# EasyEDA schematic power_distribution_board_v3.json
TITLE: Motor Controller & Power-Distribution Board; REV: 3.0; Date: 05-OCT-2024; Sheet: 1/1; Company: ABH Manufacturing.
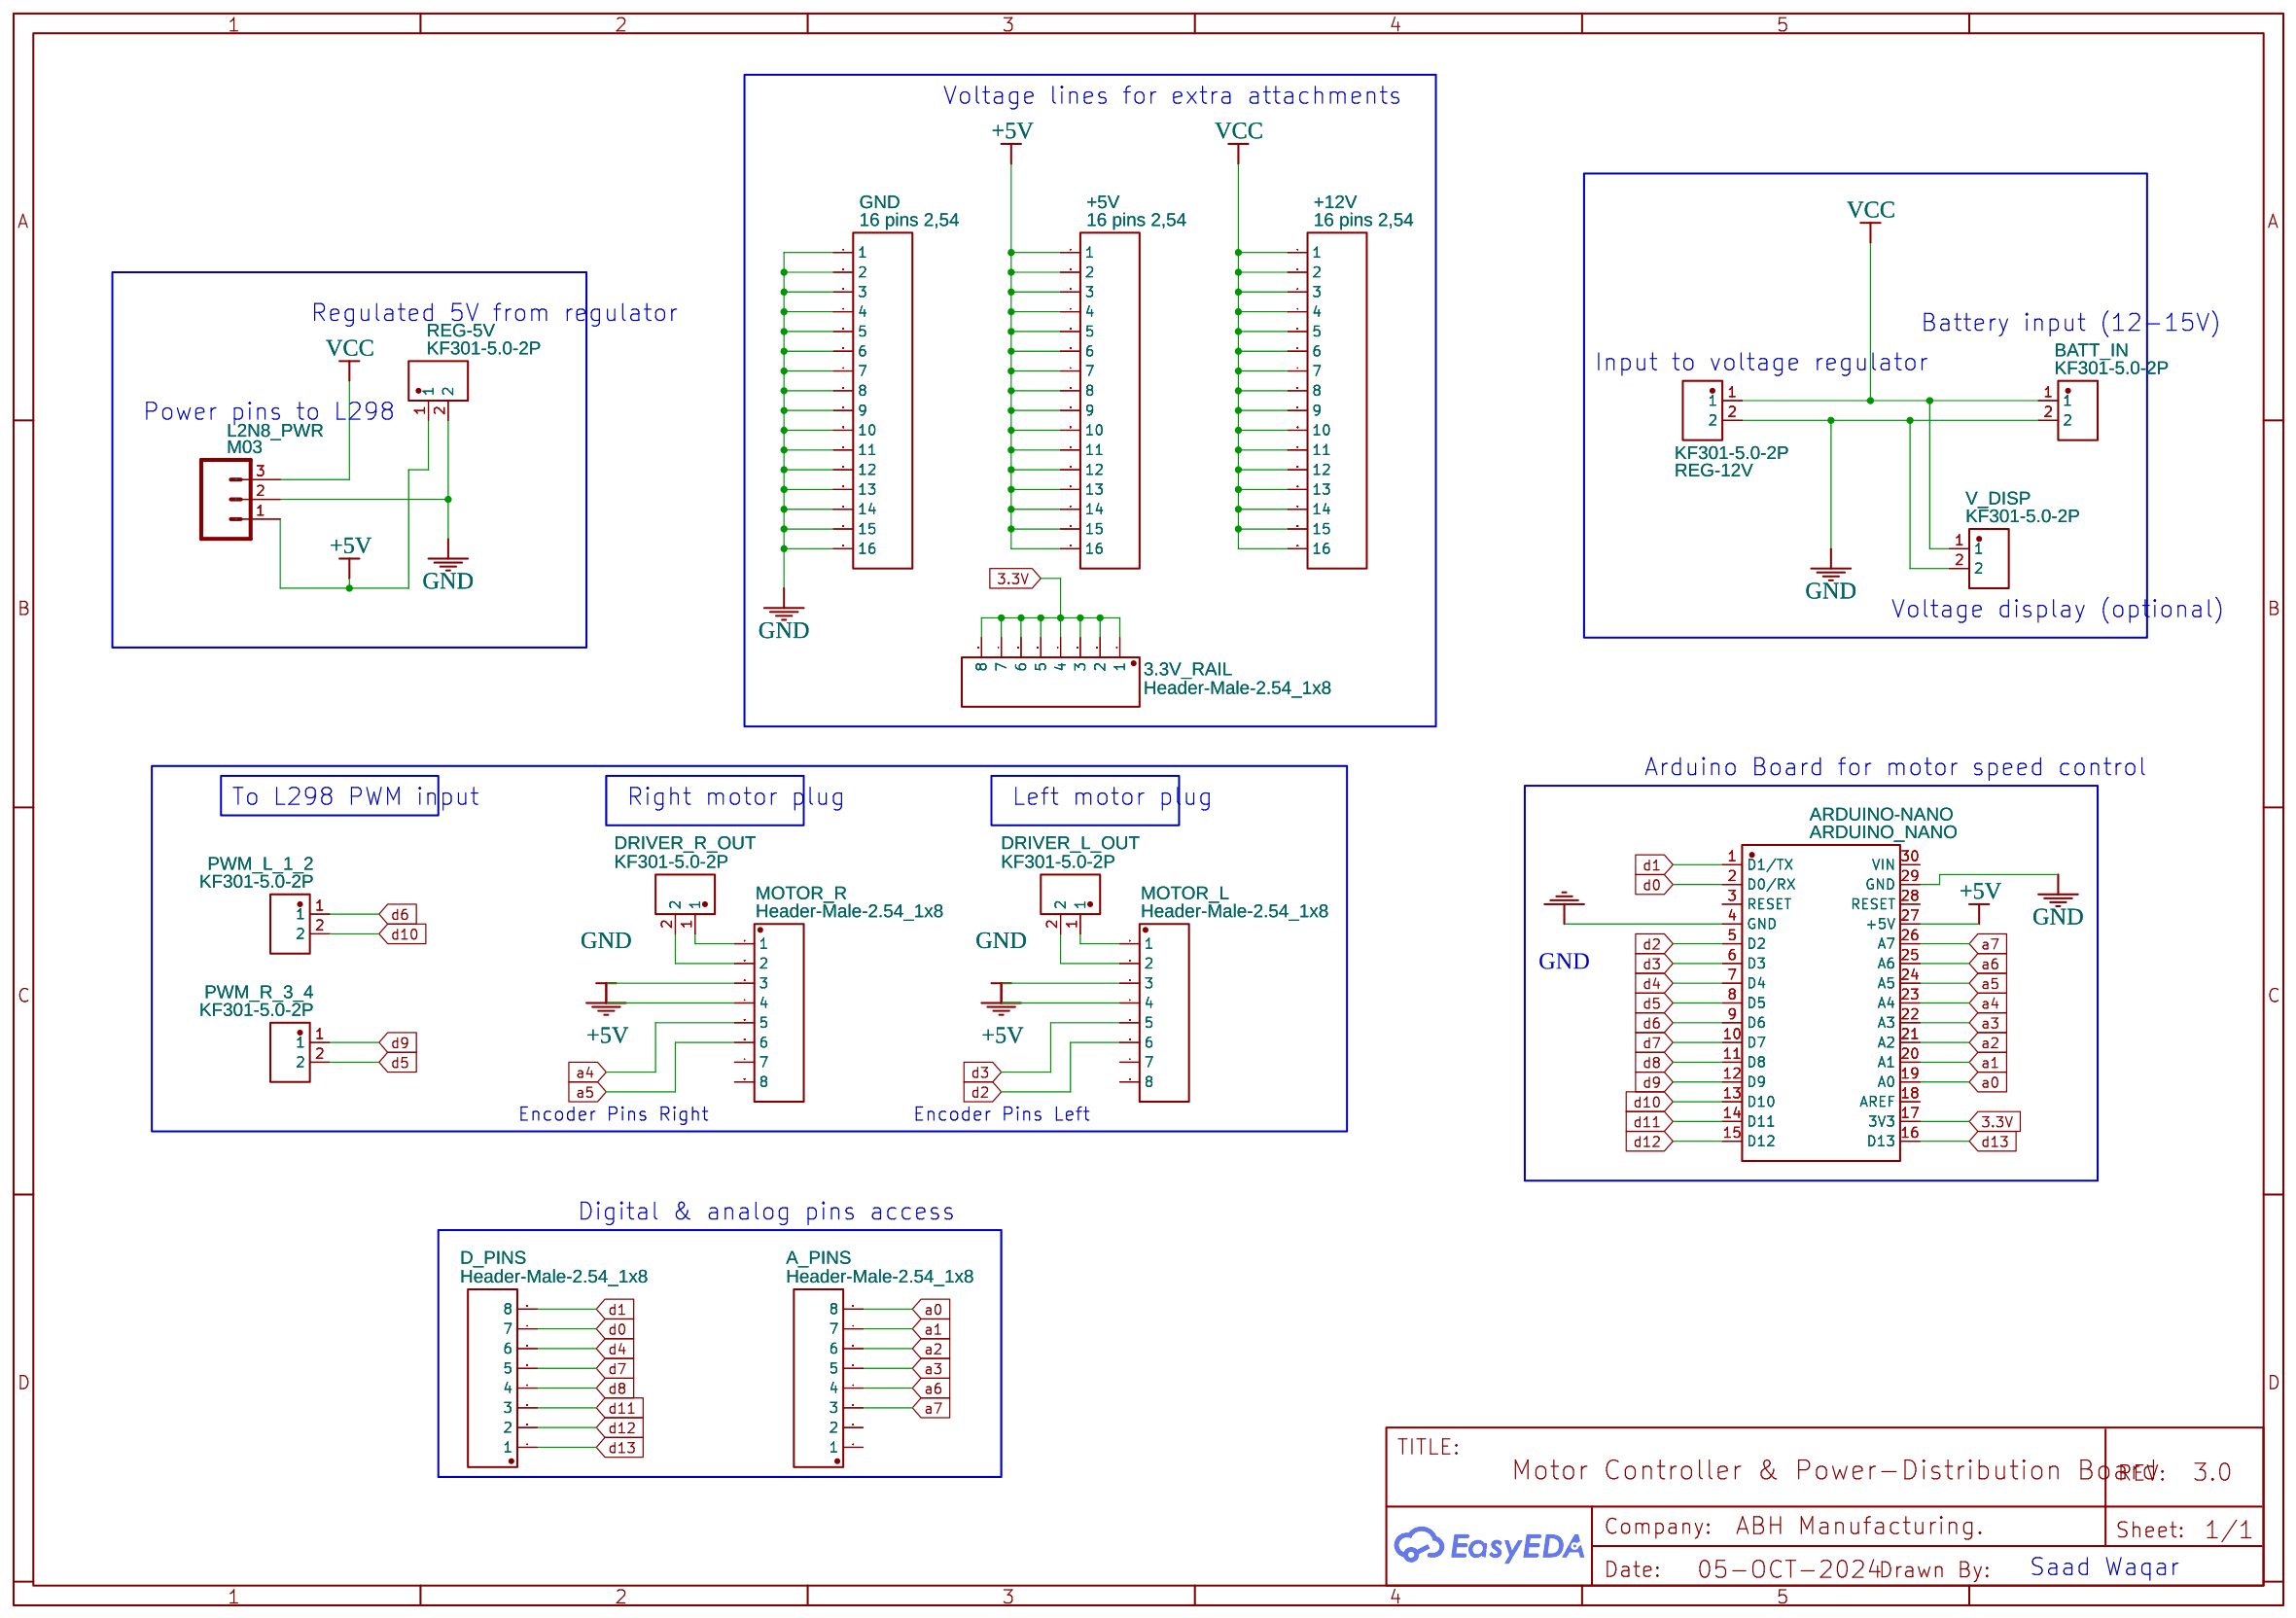
[diagram p0: schematic sheet]

## Parts
3.3V_RAIL  Header-Male-2.54_1x8  [HDR-TH_8P-P2.54-V-M]
+5V  16 pins 2,54  [16PINS 2,54]
+12V  16 pins 2,54  [16PINS 2,54]
A_PINS  Header-Male-2.54_1x8  [HDR-TH_8P-P2.54-V-M]
ARDUINO-NANO  ARDUINO_NANO  [COMM-TH_ARDUINO_NANO]
BATT_IN  KF301-5.0-2P  [CONN-TH_P5.00_KF301-5.0-2P]
D_PINS  Header-Male-2.54_1x8  [HDR-TH_8P-P2.54-V-M]
DRIVER_L_OUT  KF301-5.0-2P  [CONN-TH_P5.00_KF301-5.0-2P]
DRIVER_R_OUT  KF301-5.0-2P  [CONN-TH_P5.00_KF301-5.0-2P]
GND  16 pins 2,54  [16PINS 2,54]
L2N8_PWR  M03  [SCREWTERMINAL-5MM-3]
MOTOR_L  Header-Male-2.54_1x8  [HDR-TH_8P-P2.54-V-M]
MOTOR_R  Header-Male-2.54_1x8  [HDR-TH_8P-P2.54-V-M]
PWM_L_1_2  KF301-5.0-2P  [CONN-TH_P5.00_KF301-5.0-2P]
PWM_R_3_4  KF301-5.0-2P  [CONN-TH_P5.00_KF301-5.0-2P]
REG-5V  KF301-5.0-2P  [CONN-TH_P5.00_KF301-5.0-2P]
REG-12V  KF301-5.0-2P  [CONN-TH_P5.00_KF301-5.0-2P]
V_DISP  KF301-5.0-2P  [CONN-TH_P5.00_KF301-5.0-2P]

## Library data of the parts
3.3V_RAIL A_PINS D_PINS MOTOR_L MOTOR_R = Header-Male-2.54_1x8: Contributor: LCSC; Supplier: LCSC; Manufacturer: Ckmtw(灿科盟); Manufacturer Part: B-2100S08P-A110; Supplier Part: C124381; JLCPCB Part Class: Extended Part
+5V +12V GND = 16 pins 2,54: Contributor: olivierin8
ARDUINO-NANO = ARDUINO_NANO: Contributor: lcsc; Supplier: LCSC; Supplier Part: C9900017879; Manufacturer: null; JLCPCB Part Class: Extended Part
BATT_IN DRIVER_L_OUT DRIVER_R_OUT PWM_L_1_2 PWM_R_3_4 REG-5V REG-12V V_DISP = KF301-5.0-2P: Contributor: LCSC; Supplier: LCSC; Supplier Part: C474881; Manufacturer: KEFA(科发); JLCPCB Part Class: Extended Part
L2N8_PWR = M03: Contributor: SparkFun

## Nets
3.3V: 3.3V_RAIL.1 3.3V_RAIL.2 3.3V_RAIL.3 3.3V_RAIL.4 3.3V_RAIL.5 3.3V_RAIL.6 3.3V_RAIL.7 3.3V_RAIL.8 ARDUINO-NANO.17(3V3)
+5V: +5V.1 +5V.2 +5V.3 +5V.4 +5V.5 +5V.6 +5V.7 +5V.8 +5V.9 +5V.10 +5V.11 +5V.12 +5V.13 +5V.14 +5V.15 +5V.16 ARDUINO-NANO.27(+5V) L2N8_PWR.1 MOTOR_L.4 MOTOR_R.4 REG-5V.1
GND: ARDUINO-NANO.4(GND) ARDUINO-NANO.29(GND) BATT_IN.2 GND.1 GND.2 GND.3 GND.4 GND.5 GND.6 GND.7 GND.8 GND.9 GND.10 GND.11 GND.12 GND.13 GND.14 GND.15 GND.16 L2N8_PWR.2 MOTOR_L.3 MOTOR_R.3 REG-5V.2 REG-12V.2 V_DISP.2
VCC: +12V.1 +12V.2 +12V.3 +12V.4 +12V.5 +12V.6 +12V.7 +12V.8 +12V.9 +12V.10 +12V.11 +12V.12 +12V.13 +12V.14 +12V.15 +12V.16 BATT_IN.1 L2N8_PWR.3 REG-12V.1 V_DISP.1
a0: A_PINS.8 ARDUINO-NANO.19(A0)
a1: A_PINS.7 ARDUINO-NANO.20(A1)
a2: A_PINS.6 ARDUINO-NANO.21(A2)
a3: A_PINS.5 ARDUINO-NANO.22(A3)
a4: ARDUINO-NANO.23(A4) MOTOR_R.5
a5: ARDUINO-NANO.24(A5) MOTOR_R.6
a6: A_PINS.4 ARDUINO-NANO.25(A6)
a7: A_PINS.3 ARDUINO-NANO.26(A7)
d0: ARDUINO-NANO.2(D0/RX) D_PINS.7
d1: ARDUINO-NANO.1(D1/TX) D_PINS.8
d2: ARDUINO-NANO.5(D2) MOTOR_L.6
d3: ARDUINO-NANO.6(D3) MOTOR_L.5
d4: ARDUINO-NANO.7(D4) D_PINS.6
d5: ARDUINO-NANO.8(D5) PWM_R_3_4.2
d6: ARDUINO-NANO.9(D6) PWM_L_1_2.1
d7: ARDUINO-NANO.10(D7) D_PINS.5
d8: ARDUINO-NANO.11(D8) D_PINS.4
d9: ARDUINO-NANO.12(D9) PWM_R_3_4.1
d10: ARDUINO-NANO.13(D10) PWM_L_1_2.2
d11: ARDUINO-NANO.14(D11) D_PINS.3
d12: ARDUINO-NANO.15(D12) D_PINS.2
d13: ARDUINO-NANO.16(D13) D_PINS.1
Net-(DRIVER_L_OUT-1): DRIVER_L_OUT.1 MOTOR_L.1
Net-(DRIVER_L_OUT-2): DRIVER_L_OUT.2 MOTOR_L.2
Net-(DRIVER_R_OUT-1): DRIVER_R_OUT.1 MOTOR_R.1
Net-(DRIVER_R_OUT-2): DRIVER_R_OUT.2 MOTOR_R.2

Not connected (* = marked no-connect by the designer): A_PINS 1 2; ARDUINO-NANO 3(RESET) 18(AREF) 28(RESET) 30(VIN); MOTOR_L 7 8; MOTOR_R 7 8

## Notes on the sheet
- Voltage lines for extra attachments
- Regulated 5V from regulator
- Battery input (12-15V)
- Input to voltage regulator
- Power pins to L298
- Voltage display (optional)
- Arduino Board for motor speed control
- To L298 PWM input
- Right motor plug
- Left motor plug
- Encoder Pins Right
- Encoder Pins Left
- Digital & analog pins access
- Saad Waqar
